# Altium project AmplifierCircuit.PrjPcb
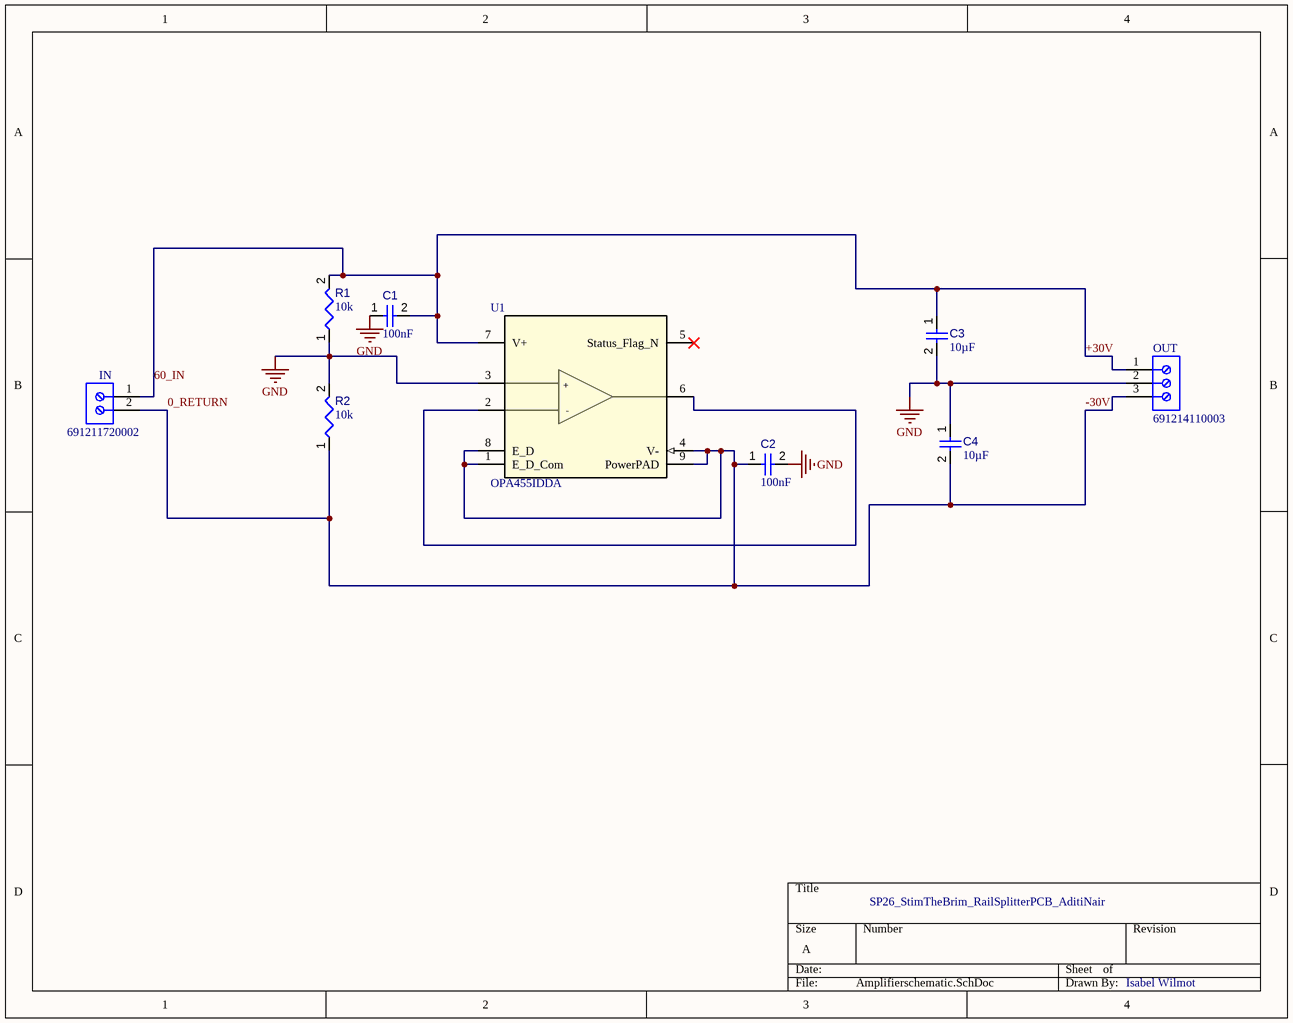
[diagram p0: Amplifierschematic.SchDoc]
1 sheet, 9 parts. Net scope: global (net labels, ports and power ports of the same name join across sheets).
Board file: PCB1.PcbDoc

## Sheet Amplifierschematic.SchDoc
size A; SheetNumber: 1; SheetTotal: 1

### Parts
C1  value 100nF  [CAPC0402(1005)60_L]  (hidden comment: Capacitor 100nF +/-20% 10V 0402)
C2  value 100nF  [CAPC0402(1005)60_L]  (hidden comment: Capacitor 100nF +/-20% 10V 0402)
C3  value 10µF  [CAPC0603(1608)100_L]  (hidden comment: Capacitor 10µF +/-20% 10V 0603)
C4  value 10µF  [CAPC0603(1608)100_L]  (hidden comment: Capacitor 10µF +/-20% 10V 0603)
IN  691211720002  [691211720002]
OUT  691214110003  [691214110003]
R1  value 10k  [RESC1005X40X25ML05T05]  (hidden comment: Resistor 10k +/-1% 0402 100 mW)
R2  value 10k  [RESC1005X40X25ML05T05]  (hidden comment: Resistor 10k +/-1% 0402 100 mW)
U1  OPA455IDDA  [DDA0008J-IPC_A]

### Nets
GND: C1.1 C2.2 C3.2 C4.1 OUT.2 R1.1 R2.2 U1.3(+IN)
+30V: C1.2 C3.1 IN.1 OUT.1 R1.2 U1.7(V+)  [also labelled 60_IN]
-30V: C2.1 C4.2 IN.2 OUT.3 R2.1 U1.1(E_D_Com) U1.4(V-) U1.8(E_D) U1.9(PowerPAD)  [also labelled 0_RETURN]
NetU1_2: U1.2(-IN) U1.6(OUT)

Not connected (* = marked no-connect by the designer): U1 5(Status_Flag_N)*

### Notes on the sheet
- SP26_StimTheBrim_RailSplitterPCB_AditiNair
- Isabel Wilmot
- (in symbol OPA455IDDA) +; -

### Library data of the parts
C1 C2 = CMP-001-00061-3: Chip Capacitor, 100nF +/-20%, 10V, 0402, Thickness 0.6 mm; Tolerance: 20%; Max Operating Temperature: 85°C; Min Operating Temperature: -55°C; Case/Package: 0402; Mounting Technology: SMT; Pins: 2; Voltage Rating: 10V
C3 C4 = CMP-001-00075-4: Chip Capacitor, 10µF +/-20%, 10V, 0603, Thickness 1 mm; Tolerance: 10%; Voltage Rating: 10V; Max Operating Temperature: 85°C; Pins: 2; Case/Package: 0603; Mounting Technology: SMT; Min Operating Temperature: -55°C
IN = CMP-1502-02524-3: 211 Series 5MM Pitch Straight, Pcb Terminal Block, Through Hole, 2 Way; Number of Levels: 1; Current: 10A; Voltage: 300V; Pitch: 5.0038mm; Wire Gauge (Min): 12AWG; Connector Type: PCB, Terminal Block; Number of Positions Per Level: 2; Plating: Brass, Steel; Wire Gauge (Max): 24AWG; Stripping Length: -7mm; Termination: Screw; Height: 15.5mm; Contact Plating: Tin; REACH SVHC: Unknown; Contact Material: Brass; Width: 10mm; RoHS: Compliant; Number of Pins: 2; Lead Pitch: 5mm; Mount: Through Hole; Min Operating Temperature: -40°C; Length: 13.7mm; Number of Contacts: 2; Color: Green; Wire/Cable Gauge: 12AWG; Housing Material: Nylon; Packaging: Box; Max Operating Temperature: 105°C
OUT = CMP-1502-02466-3: 2141 Series 3.5MM Pitch Straight, Pcb Terminal Block, Through Hole, 3 Way; Wire Gauge (Max): 24AWG; Current Rating: 10A; Wire Gauge (Min): 16AWG; Plating: Brass, Steel; Number of Levels: 1; Voltage Rating: 300V; Number of Contacts: 3; Pitch: 3.5052mm; Stripping Length: -6mm; Min Operating Temperature: -40°C; Height: 12.2mm; Length: 7.4mm; Termination: Screw; Contact Plating: Brass, Tin; Housing Material: Nylon; Packaging: Box; Contact Material: Brass; Max Operating Temperature: 105°C; Number of Pins: 3; Wire/Cable Gauge: 24AWG; Lead Pitch: 3.5mm; Width: 10.9mm; Color: Blue, Green; Number of Positions Per Level: 3; Mount: Through Hole; RoHS: Compliant; Voltage: 300V; Current: 10A
R1 R2 = CMP-009-00015-5: Chip Resistor, 10 KOhm, +/- 1%, 0.1 W, -55 to 155 degC, 0402 (1005 Metric); Power: 100mW; Voltage Rating: 50V; Min Operating Temperature: -55°C; Tolerance: 1%; Case/Package: 0402; Mounting Technology: SM; RoHS Compliant: True; Max Operating Temperature: 155°C; Pins: 2
U1 = OPA455IDDA: 150-V, wide bandwidth 6.5-MHz, high-slew rate 32-V/Âµs unity-gain stable op amp 8-SO PowerPAD -40 to 85; Manufacturer_Name: Texas Instruments; TYPE: TYPE; RefDes: RefDes; Copyright: Copyright (C) 2026 Ultra Librarian. All rights reserved.; Manufacturer_Part_Number: OPA455IDDA; Datasheet: https://www.ti.com/lit/gpn/opa455